# Altium project PanierPiano.PrjPCB
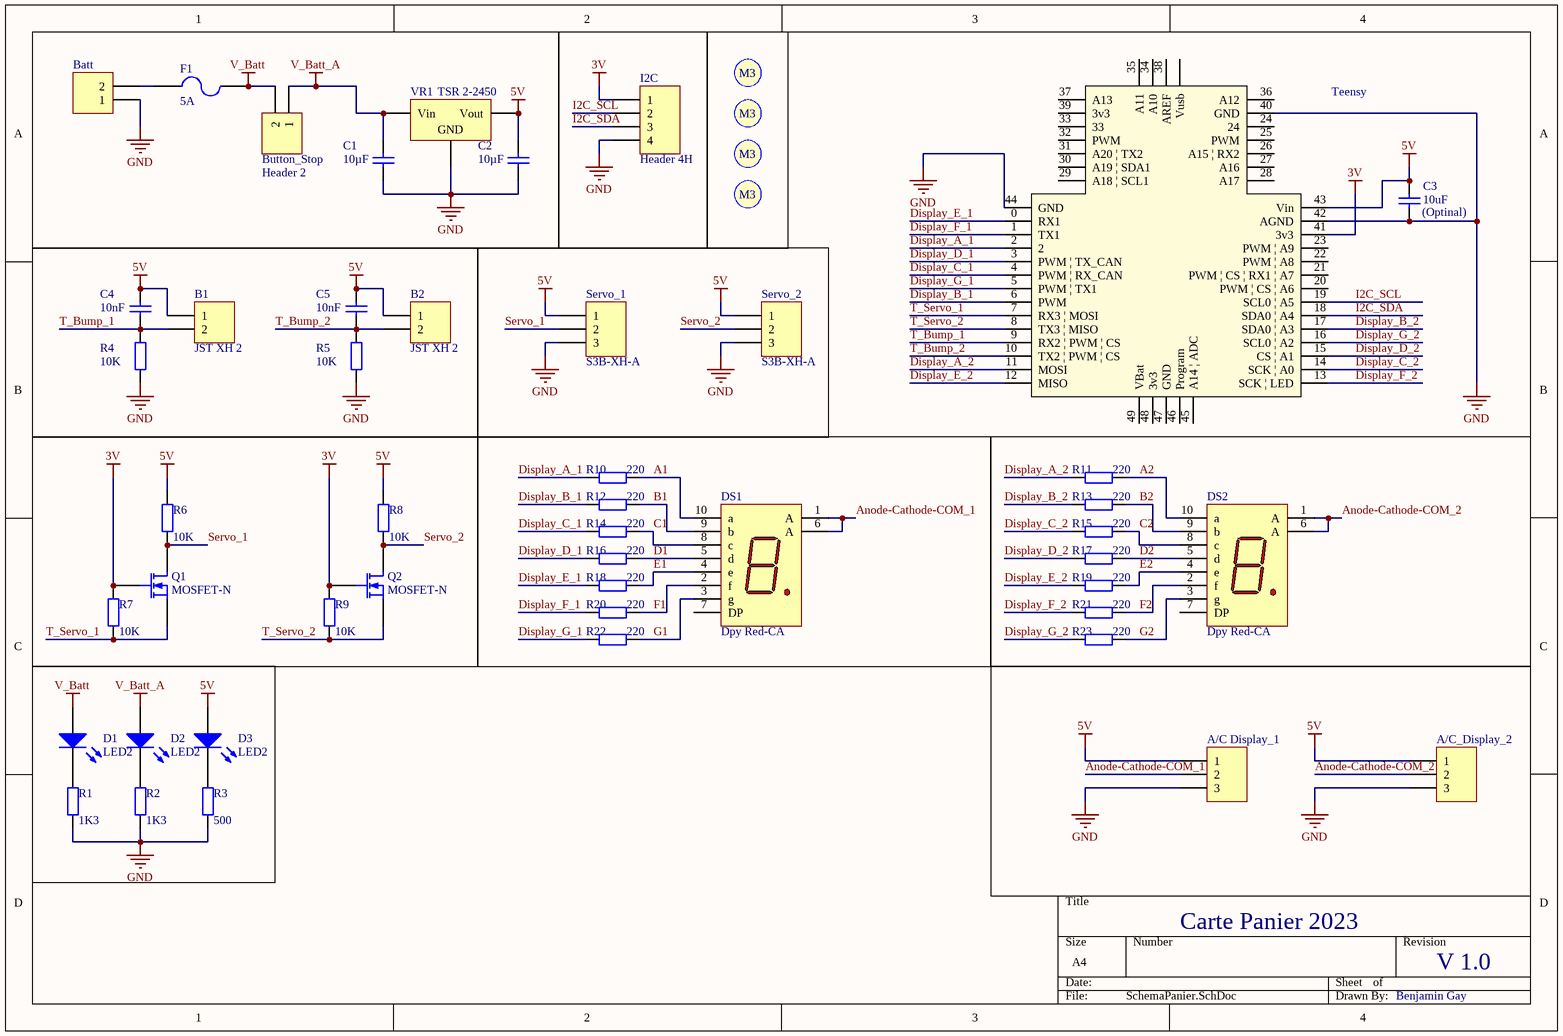
[diagram p0: SchemaPanier.SchDoc]
1 sheet, 51 parts. Net scope: global (net labels, ports and power ports of the same name join across sheets).
Board file: PCBPanier.PcbDoc

## Sheet SchemaPanier.SchDoc
size A4

### Parts
A/C_Display_1  Common_7-segments  [HDR1X3]  (value not drawn)
A/C_Display_2  Common_7-segments  [HDR1X3]  (value not drawn)
B1  JST XH 2  [S2B-XH-A]
B2  JST XH 2  [S2B-XH-A]
Batt  (no value)  [Battery SALE]
Button_Stop  Header 2  [Molex_MiniFitJr_2x1H]
C1  value 10µF  [Capacitor 1206]  (hidden comment: Cap)
C2  value 10µF  [Capacitor 1206]  (hidden comment: Cap)
C3  (Optinal)  value 10uF  [Capacitor 1206]
C4  value 10nF  [Capacitor 1206]  (hidden comment: Cap)
C5  value 10nF  [Capacitor 1206]  (hidden comment: Cap)
D1  LED2  [KP-3216SEC]
D2  LED2  [KP-3216SEC]
D3  LED2  [KP-3216SEC]
DS1  Dpy Red-CA  [7 segments 5082-7731]
DS2  Dpy Red-CA  [7 segments 5082-7731]
F1  5A  [Fuse]
I2C  Header 4H  [S4B-XH-A]
Q1  MOSFET-N  [SOT23_M]
Q2  MOSFET-N  [SOT23_M]
R1  value 1K3  [Resistor 1206]
R2  value 1K3  [Resistor 1206]
R3  value 500  [Resistor 1206]
R4  value 10K  [Resistor 1206]  (hidden comment: Res2)
R5  value 10K  [Resistor 1206]  (hidden comment: Res2)
R6  value 10K  [Resistor 1206]
R7  value 10K  [Resistor 1206]
R8  value 10K  [Resistor 1206]
R9  value 10K  [Resistor 1206]
R10  value 220  [Resistor 1206]  (hidden comment: Res2)
R11  value 220  [Resistor 1206]  (hidden comment: Res2)
R12  value 220  [Resistor 1206]  (hidden comment: Res2)
R13  value 220  [Resistor 1206]  (hidden comment: Res2)
R14  value 220  [Resistor 1206]  (hidden comment: Res2)
R15  value 220  [Resistor 1206]  (hidden comment: Res2)
R16  value 220  [Resistor 1206]  (hidden comment: Res2)
R17  value 220  [Resistor 1206]  (hidden comment: Res2)
R18  value 220  [Resistor 1206]  (hidden comment: Res2)
R19  value 220  [Resistor 1206]  (hidden comment: Res2)
R20  value 220  [Resistor 1206]  (hidden comment: Res2)
R21  value 220  [Resistor 1206]  (hidden comment: Res2)
R22  value 220  [Resistor 1206]  (hidden comment: Res2)
R23  value 220  [Resistor 1206]  (hidden comment: Res2)
S1  Screw M3  [Screw M3]  (value not drawn)
S2  Screw M3  [Screw M3]  (value not drawn)
S3  Screw M3  [Screw M3]  (value not drawn)
S4  Screw M3  [Screw M3]  (value not drawn)
Servo_1  S3B-XH-A  [S3B-XH-A]
Servo_2  S3B-XH-A  [S3B-XH-A]
Teensy  Teensy 3.2  [teensy]  (value not drawn)
VR1  TSR 2-2450  [TRS]

### Nets
3V: I2C.1 Q1.2(G) Q2.2(G) R7.2 R9.2 Teensy.41(3v3)
5V: A/C_Display_1.1 A/C_Display_2.1 B1.1 B2.1 C2.2 C3.2 C4.2 C5.2 D3.1(A) R6.2 R8.2 Servo_1.1 Servo_2.1 Teensy.43(Vin) VR1.3(Vout)
GND: A/C_Display_1.3 A/C_Display_2.3 Batt.1 C1.1 C2.1 C3.1 I2C.4 R1.1 R2.1 R3.1 R4.2 R5.2 Servo_1.3 Servo_2.3 Teensy.40(GND) Teensy.42(AGND) Teensy.44(GND) VR1.2(GND)
V_Batt: Button_Stop.2 D1.1(A) F1.2
V_Batt_A: Button_Stop.1 C1.2 D2.1(A) VR1.1(Vin)
A1: DS1.10(a) R10.2
A2: DS2.10(a) R11.2
Anode-Cathode-COM_1: A/C_Display_1.2 DS1.1(A) DS1.6(A)
Anode-Cathode-COM_2: A/C_Display_2.2 DS2.1(A) DS2.6(A)
B1: DS1.9(b) R12.2
B2: DS2.9(b) R13.2
C1: DS1.8(c) R14.2
C2: DS2.8(c) R15.2
D1: DS1.5(d) R16.2
D2: DS2.5(d) R17.2
Display_A_1: R10.1 Teensy.2
Display_A_2: R11.1 Teensy.11(MOSI)
Display_B_1: R12.1 Teensy.6(PWM)
Display_B_2: R13.1 Teensy.17(SDA0_|_A3)
Display_C_1: R14.1 Teensy.4(PWM_|_RX_CAN)
Display_C_2: R15.1 Teensy.14(SCK_|_A0)
Display_D_1: R16.1 Teensy.3(PWM_|_TX_CAN)
Display_D_2: R17.1 Teensy.15(CS_|_A1)
Display_E_1: R18.1 Teensy.0(RX1)
Display_E_2: R19.1 Teensy.12(MISO)
Display_F_1: R20.1 Teensy.1(TX1)
Display_F_2: R21.1 Teensy.13(SCK_|_LED)
Display_G_1: R22.1 Teensy.5(PWM_|_TX1)
Display_G_2: R23.1 Teensy.16(SCL0_|_A2)
E1: DS1.4(e) R18.2
E2: DS2.4(e) R19.2
F1: DS1.2(f) R20.2
F2: DS2.2(f) R21.2
G1: DS1.3(g) R22.2
G2: DS2.3(g) R23.2
I2C_SCL: I2C.2 Teensy.19(SCL0_|_A5)
I2C_SDA: I2C.3 Teensy.18(SDA0_|_A4)
Servo_1: Q1.1(D) R6.1 Servo_1.2
Servo_2: Q2.1(D) R8.1 Servo_2.2
T_Bump_1: B1.2 C4.1 R4.1 Teensy.9(RX2_|_PWM_|_CS)
T_Bump_2: B2.2 C5.1 R5.1 Teensy.10(TX2_|_PWM_|_CS)
T_Servo_1: Q1.3(S) R7.1 Teensy.7(RX3_|_MOSI)
T_Servo_2: Q2.3(S) R9.1 Teensy.8(TX3_|_MISO)
NetBatt_2: Batt.2 F1.1
NetD1_2: D1.2(K) R1.2
NetD2_2: D2.2(K) R2.2
NetD3_2: D3.2(K) R3.2

Not connected (* = marked no-connect by the designer): DS1 7(DP); DS2 7(DP); Teensy 20(PWM_|_CS_|_A6) 21(PWM_|_CS_|_RX1_|_A7) 22(PWM_|_A8) 23(PWM_|_A9) 24 25(PWM) 26(A15_|_RX2) 27(A16) 28(A17) 29(A18_|_SCL1) 30(A19_|_SDA1) 31(A20_|_TX2) 32(PWM) 33 34(A10) 35(A11) 36(A12) 37(A13) 38(AREF) 39(3v3) 45(A14_|_ADC) 46(Program) 47(GND) 48(3v3) 49(VBat) 50(Vusb)

### Notes on the sheet
- Carte Panier 2023
- V 1.0
- Benjamin Gay
- (in symbol Screw M3) M3

### Library data of the parts
A/C_Display_1 A/C_Display_2 = Header 3: Header, 3-Pin; LatestRevisionDate: 17-Jul-2002; LatestRevisionNote: Re-released for DXP Platform.; Publisher: Altium Limited
B1 B2 Batt Button_Stop = Header 2: Header, 2-Pin; LatestRevisionDate: 17-Jul-2002; LatestRevisionNote: Re-released for DXP Platform.; Publisher: Altium Limited
C1-C5 = Cap: Capacitor; Published: 8-Jun-2000; LatestRevisionDate: 17-Jul-2002; LatestRevisionNote: Re-released for DXP Platform.; PackageReference: RAD-0.3; Publisher: Altium Limited; PackageDescription: Radial Cap, Thru-Hole; 2 Leads; 0.3 in Pin Spacing
D1-D3 = LED2: Typical RED, GREEN, YELLOW, AMBER GaAs LED; Published: 8-Jun-2000; LatestRevisionDate: 17-Jul-2002; LatestRevisionNote: Re-released for DXP Platform.; PackageVersion: Feb-2002; PackageReference: 3.2X1.6X1.1; Publisher: Altium Limited; PackageDescription: SM LED; 2 Flat Leads
DS1 DS2 = Dpy Red-CA: 7.62 mm Black Surface HER 7-Segment Display: CA, RH DP; MinimumIntensity: 360 ucd; Note: IF = 5 mA; Colour: High Efficiency Red (HER); Note: Pins 1 and 6 are redundant Anodes.; Published: 8-Jun-2000; LatestRevisionDate: 17-Dec-2003; LatestRevisionNote: Schematic revised, PCB Footprint replaced.; DatasheetVersion: 19-Feb-2002; PackageVersion: 11-Feb-2002; PackageReference: A; Publisher: Altium Limited; PackageDescription: LED, 7-Segment Display, 7.62 mm, RHD; 10 Leads; Row Space 5.08 mm; Pitch 2.54 mm; ComponentLink1Description: Manufacturer Link; ComponentLink1URL: http://www.agilent.com/
F1 = Fuse 2: Fuse; Published: 8-Jun-2000; LatestRevisionDate: 17-Jul-2002; LatestRevisionNote: Re-released for DXP Platform.; PackageReference: PIN-W2/E2.8; Publisher: Altium Limited; PackageDescription: Thru-Hole; 2 Leads
I2C = Header 4H: Header, 4-Pin, Right Angle; LatestRevisionDate: 17-Jul-2002; LatestRevisionNote: Re-released for DXP Platform.; Publisher: Altium Limited
Q1 Q2 = MOSFET-N: N-Channel MOSFET; pin to pad: 2>3 3>2; Published: 8-Jun-2000; LatestRevisionDate: 17-Jul-2002; LatestRevisionNote: Re-released for DXP Platform.; PackageVersion: 1995/1996; PackageReference: E3; Publisher: Altium Limited; PackageDescription: TO, Flat Index; 3 In-Line, Axial Leads; Body Dia. 4.6mm; Lead Dia. 0.5 mm (max)
R1-R23 = Res2: Resistor; Published: 8-Jun-2000; LatestRevisionDate: 17-Jul-2002; LatestRevisionNote: Re-released for DXP Platform.; PackageReference: AXIAL-0.4; Publisher: Altium Limited; PackageDescription: Axial Device, Thru-Hole; 2 Leads; 0.4 in Pin Spacing
Servo_1 Servo_2 = Header 3H: Header, 3-Pin, Right Angle; LatestRevisionDate: 17-Jul-2002; LatestRevisionNote: Re-released for DXP Platform.; Publisher: Altium Limited
Teensy = teensy3.2
VR1 = Volt Reg: Voltage Regulator; Published: 24-Mar-1999; LatestRevisionDate: 29-May-2009; LatestRevisionNote: IPC-7351 Footprint Added.; PackageReference: D2PAK; Publisher: Altium Limited; PackageDescription: 3-Pin Transistor Outline Package 2.54 mm Pitch, 15.1 mm Lead Span